# Altium project Self-Oscillating Converter.PrjPCB
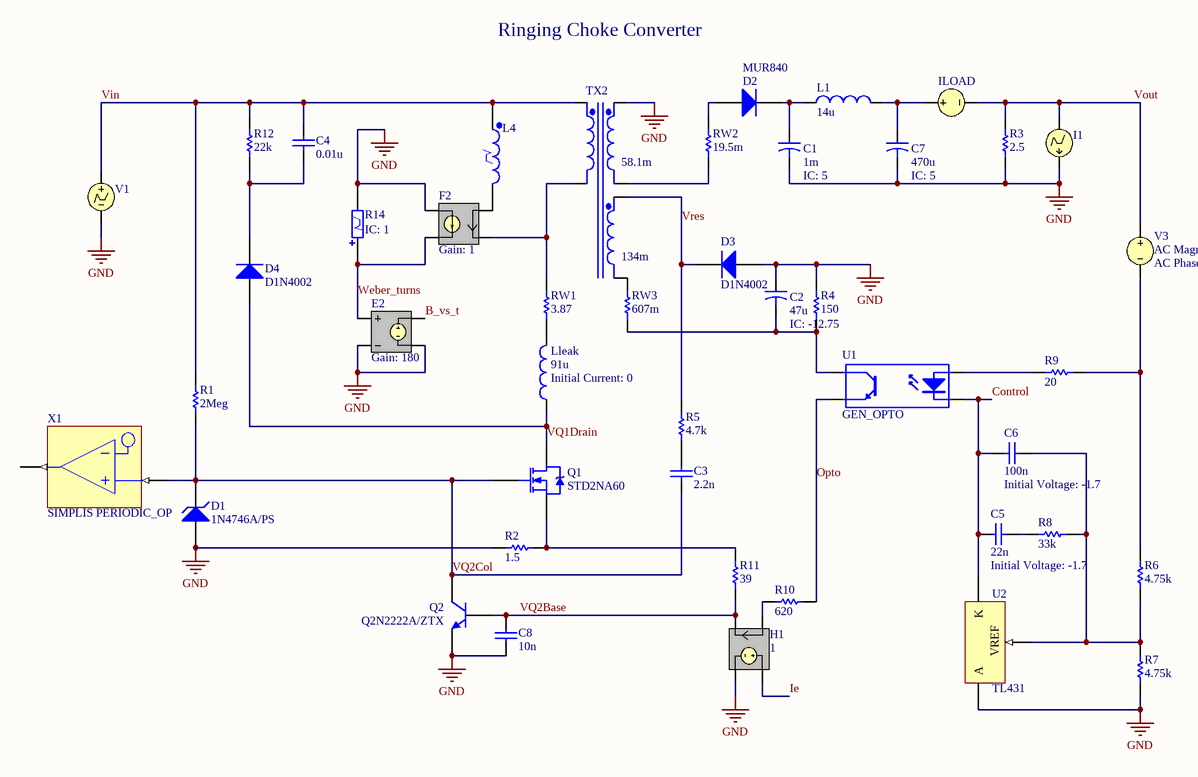
[diagram p0: Self-Oscillating Converter.SchDoc]
1 sheet, 44 parts. Net scope: global (net labels, ports and power ports of the same name join across sheets).

## Sheet Self-Oscillating Converter.SchDoc
size A4

### Parts
C1  IC: 5  CC: 1m  [CAPR5-4X5]  (hidden comment: Cap Elec (L1-3))
C2  IC: -12.75  CC: 47u  [CAPR5-4X5]  (hidden comment: Cap Elec (L1-3))
C3  value 2.2n  [RAD-0.3]  (hidden comment: Cap)
C4  value 0.01u  [RAD-0.3]  (hidden comment: Cap)
C5  value 22n  Initial Voltage: -1.7  [RAD-0.3]  (hidden comment: Cap)
C6  value 100n  Initial Voltage: -1.7  [RAD-0.3]  (hidden comment: Cap)
C7  IC: 5  CC: 470u  [CAPR5-4X5]  (hidden comment: Cap Elec (L1-3))
C8  value 10n  [RAD-0.3]  (hidden comment: Cap)
D1  1N4746A/PS  [59-03]
D2  MUR840  [SMC]
D3  D1N4002  [DO-41]
D4  D1N4002  [DO-41]
E2  Gain: 180  (hidden comment: ESRC)
F2  Gain: 1  (hidden comment: FSRC)
H1  Gain: 1  (hidden comment: HSRC)
I1  IPWL  (value not drawn)
ILOAD  VSRC  (value not drawn)
L1  value 14u  [0402-A]  (hidden comment: Lossy Inductor)
L4  SIMPLIS PWLL5  (value not drawn)
Lleak  value 91u  Initial Current: 0  [0402-A]  (hidden comment: Inductor)
Q1  STD2NA60  [TO-220AB]
Q2  Q2N2222A/ZTX  [TO-18]
R1  value 2Meg  [AXIAL-0.3]  (hidden comment: Res1)
R2  value 1.5  [AXIAL-0.3]  (hidden comment: Res1)
R3  value 2.5  [AXIAL-0.3]  (hidden comment: Res1)
R4  value 150  [AXIAL-0.3]  (hidden comment: Res1)
R5  value 4.7k  [AXIAL-0.3]  (hidden comment: Res1)
R6  value 4.75k  [AXIAL-0.3]  (hidden comment: Res1)
R7  value 4.75k  [AXIAL-0.3]  (hidden comment: Res1)
R8  value 33k  [AXIAL-0.3]  (hidden comment: Res1)
R9  value 20  [AXIAL-0.3]  (hidden comment: Res1)
R10  value 620  [AXIAL-0.3]  (hidden comment: Res1)
R11  value 39  [AXIAL-0.3]  (hidden comment: Res1)
R12  value 22k  [AXIAL-0.3]  (hidden comment: Res1)
R14  IC: 1  (hidden comment: SIMPLIS VPWLR5)
RW1  value 3.87  [AXIAL-0.3]  (hidden comment: Res1)
RW2  value 19.5m  [AXIAL-0.3]  (hidden comment: Res1)
RW3  value 607m  [AXIAL-0.3]  (hidden comment: Res1)
TX2  Ratio1: 58.1m  Ratio2: 134m  [TRF_6]  (hidden comment: Trans3 Ideal)
U1  GEN_OPTO  [DIP-4]
U2  TL431  [LP03]
V1  VPWL  (value not drawn)
V3  AC Magnitude: 1  AC Phase: 0  (hidden comment: VSRC)
X1  SIMPLIS PERIODIC_OP

### Nets
GND: C1.2 C2.1 C7.2 C8.2 D1.1(A) D3.1(A) E2.2(NC-) E2.4(N-) F2.3(N+) H1.4(N-) I1.2 Q2.1(E) R2.1 R3.2 R4.1 R7.1 R14.2 TX2.3(Sec1+) U2.2(A) V1.2
B_vs_t: E2.3(N+)
Control: C5.2 C6.2 U1.2(K) U2.3(K)
Ie: H1.3(N+)
Opto: R10.1 U1.3(E)
Vin: C4.1 L4.1 R1.1 R12.1 TX2.1(Pri+) V1.1
Vout: I1.1 ILOAD.2 R3.1 V3.1
VQ1Drain: D4.1(A) Lleak.1 Q1.2(D)
VQ2Base: C8.1 H1.2(NC-) Q2.2(B) R11.1
VQ2Col: C3.1 D1.2(K) Q1.1(G) Q2.3(C) R1.2 X1.1(IN)
Vres: D3.2(K) R5.1 TX2.5(Sec2+)
Weber_turns: E2.1(NC+) F2.4(N-) R14.1
NetC1_1: C1.1 D2.2(K) L1.1
NetC2_2: C2.2 R4.2 RW3.2 U1.4(C)
NetC3_2: C3.2 R5.2
NetC4_2: C4.2 D4.2(K) R12.2
NetC5_1: C5.1 R8.1
NetC6_1: C6.1 R6.1 R7.2 R8.2 U2.1(VREF)
NetC7_1: C7.1 ILOAD.1 L1.2
NetD2_1: D2.1(A) RW2.1
NetF2_1: F2.1(NC+) L4.2
NetF2_2: F2.2(NC-) RW1.1 TX2.2(Pri-)
NetH1_1: H1.1(NC+) R10.2
NetLleak_2: Lleak.2 RW1.2
NetQ1_3: Q1.3(S) R2.2 R11.2
NetR6_2: R6.2 R9.2 V3.2
NetR9_1: R9.1 U1.1(A)
NetRW2_2: RW2.2 TX2.4(Sec1-)
NetRW3_1: RW3.1 TX2.6(Sec2-)

Not connected (* = marked no-connect by the designer): X1 3(OUT)

### Notes on the sheet
- Ringing Choke Converter

### Library data of the parts
C1 = Cap Elec (L1-3): Electrolytic Capacitor (Levels 1-3); LEVEL: 2; RSH_CC: 1Meg; RESR: 40m; USEIC: 1; Published: 23-Sep-2002; PackageReference: CAPR5-4X5; Publisher: Altium Limited
C2 = Cap Elec (L1-3): Electrolytic Capacitor (Levels 1-3); LEVEL: 2; RSH_CC: 1Meg; RESR: 950m; USEIC: 1; Published: 23-Sep-2002; PackageReference: CAPR5-4X5; Publisher: Altium Limited
C3-C6 C8 = Cap: Capacitor; Published: 8-Jun-2000; LatestRevisionDate: 17-Jul-2002; LatestRevisionNote: Re-released for DXP Platform.; PackageReference: RAD-0.3; Publisher: Altium Limited
C7 = Cap Elec (L1-3): Electrolytic Capacitor (Levels 1-3); LEVEL: 2; RSH_CC: 1Meg; RESR: 290m; USEIC: 1; Published: 23-Sep-2002; PackageReference: CAPR5-4X5; Publisher: Altium Limited
D1 = 1N4746A/PS: One Watt Hermetically Sealed Glass Silicon Zener Diode; Published: 29-Sep-2000; LatestRevisionDate: 17-Jul-2002; LatestRevisionNote: Re-released for DXP Platform.; PackageReference: 59-03; Publisher: Altium Limited; PackageDescription: Diode, Axial; Body 5.2 x 2.7 mm (LxDia. max), Lead Dia. 0.86 mm (max); Code_JEDEC: DO-204-AL; ComponentLink1Description: Manufacturer Link; ComponentLink1URL: http://www.onsemi.com/site/products/landing?taxonomyID=194
D2 = MUR840: Ultrafast Recovery Rectifier; Published: 8-Jun-2000; LatestRevisionDate: 17-Jul-2002; LatestRevisionNote: Re-released for DXP Platform.; PackageDocument: Sep-1996; PackageReference: SMC; Publisher: Altium Limited; Code_JEDEC: DO-214-AB
D3 D4 = D1N4002: 1 Amp General Purpose Rectifier; Published: 8-Jun-2000; LatestRevisionDate: 17-Jul-2002; LatestRevisionNote: Re-released for DXP Platform.; DatasheetDocument: 1998; PackageDocument: Aug-1999; PackageReference: DO-41; Publisher: Altium Limited; Code_JEDEC: DO-204-AL; ComponentLink1Description: Manufacturer Link; ComponentLink1URL: http://www.fairchildsemi.com/; ComponentLink2Description: Datasheet; ComponentLink2URL: http://www.fairchildsemi.com/ds/1N%2F1N4001.pdf
E2 = ESRC: Voltage Controlled Voltage Source; Note: PCB Footprint - Not required; Sim Note: Enter gain into gain field; Published: 8-Jun-2000; LatestRevisionDate: 17-Jul-2002; LatestRevisionNote: Re-released for DXP Platform.; PackageReference: Not Applicable; Publisher: Altium Limited
F2 = FSRC: Current Controlled Current Source; Note: PCB Footprint - Not required; Sim Note: Enter gain into GAIN field; Published: 8-Jun-2000; LatestRevisionDate: 17-Jul-2002; LatestRevisionNote: Re-released for DXP Platform.; PackageReference: Not Applicable; Publisher: Altium Limited
H1 = HSRC: Current Controlled Voltage Source; Note: PCB Footprint - Not required; Sim Note: Enter gain into gain field; Published: 8-Jun-2000; LatestRevisionDate: 17-Jul-2002; LatestRevisionNote: Re-released for DXP Platform.; PackageReference: Not Applicable; Publisher: Altium Limited
I1 = IPWL: Piecewise Linear Current Source; Sim Note: To add model file containing time-current pairs of values, enter model location under "General Tab" in "Full Path" box.; Time-Value Pairs: 0 0 99.99999u 0 100u 1; Published: 8-Jun-2000; LatestRevisionDate: 17-Jul-2002; LatestRevisionNote: Re-released for DXP Platform.; PackageReference: Not Applicable; Publisher: Altium Limited
ILOAD V3 = VSRC: Voltage Source; Note: PCB Footprint - Not required; Value: 0; Published: 8-Jun-2000; LatestRevisionDate: 17-Jul-2002; LatestRevisionNote: Re-released for DXP Platform.; PackageReference: Not Applicable; Publisher: Altium Limited
L1 = Inductor (Lossy): Code_IEC: 1005; RSERIES: 10m; RSHUNT: 1Meg; Published: 8-Jun-2000; LatestRevisionDate: 17-Jul-2002; LatestRevisionNote: Re-released for DXP Platform.; PackageReference: 0402-A; Publisher: Altium Limited; Code_JEITA: 0402
L4 = SIMPLIS PWLL5: Piecewise Linear Inductor (5-segment); X0: -0.50; Y0: -1.655m; X1: -0.45; Y1: -1.65m; X2: -0.40; Y2: -1.6m; X3: 0.40; Y3: 1.6m; X4: 0.45; Y4: 1.65m; X5: 0.50; Y5: 1.655m; Published: 24-Mar-1999; LatestRevisionDate: 17-Jul-2002; LatestRevisionNote: Re-released for DXP Platform.; PackageReference: DIODE_SMC; Publisher: Altium Limited
Lleak = Inductor: Code_IEC: 1005; Published: 8-Jun-2000; LatestRevisionDate: 17-Jul-2002; LatestRevisionNote: Re-released for DXP Platform.; PackageReference: 0402-A; Publisher: Altium Limited; Code_JEITA: 0402
Q1 = STD2NA60: N-Channel Enhancement Mode Power MOS Transistor; Note: Pin 2 is electrically connected to pin 4.; Published: 8-Jun-2000; LatestRevisionDate: 17-Jul-2002; LatestRevisionNote: Re-released for DXP Platform.; DatasheetVersion: PD-9.307O; PackageVersion: Feb-1997; PackageReference: TO-220AB; Publisher: Altium Limited; PackageDescription: TO, Thru-Hole, Vertical, Heatsink Mounted; 3 In-Line Leads; Pitch 2.54 mm; ComponentLink1Description: Manufacturer Link; ComponentLink1URL: http://www.irf.com/; ComponentLink2Description: Datasheet; ComponentLink2URL: http://www.irf.com/product-info/datasheets/data/irf530.pdf
Q2 = Q2N2222A/ZTX: Zetex General Purpose Transistor NPN Silicon; Published: 29-Sep-2000; LatestRevisionDate: 17-Jul-2002; LatestRevisionNote: Re-released for DXP Platform.; DatasheetVersion: 1991; PackageVersion: 1997; PackageReference: 22-03; Publisher: Altium Limited; PackageDescription: Can; 3 Leads; Pin Circle Dia. 2.54 mm; Lead Dia. 0.48 mm (max); ComponentLink1Description: Manufacturer Link; ComponentLink1URL: http://www.onsemi.com/site/products/landing?taxonomyID=194
R1-R12 RW1-RW3 = Res1: Resistor; Published: 8-Jun-2000; LatestRevisionDate: 17-Jul-2002; LatestRevisionNote: Re-released for DXP Platform.; PackageReference: AXIAL-0.3; Publisher: Altium Limited
R14 = SIMPLIS VPWLR5: Voltage-Controlled Piecewise Linear Resistor (5-segment); X0: -1.655m; Y0: -0.5; X1: -1.65m; Y1: -0.45; X2: -1.6m; Y2: -0.4; X3: 1.6m; Y3: 0.4; X4: 1.65m; Y4: 0.45; X5: 1.655m; Y5: 0.5; Published: 24-Mar-1999; LatestRevisionDate: 04-Mar-2005; LatestRevisionNote: PCB Footprint replaced.; PackageReference: 6-0805; Publisher: Altium Limited
TX2 = Trans3 Ideal: Three-winding Transformer (Ideal); Published: 25-Jan-2001; LatestRevisionDate: 17-Jul-2002; LatestRevisionNote: Re-released for DXP Platform.; PackageReference: TRF_6; Publisher: Altium Limited
U1 = GEN_OPTO: General-Purpose Optocoupler; Published: 24-Mar-1999; LatestRevisionDate: 04-Mar-2005; LatestRevisionNote: Sch pins 3 & 4 Swapped.; DatasheetDocument: Nov-2003; PackageReference: DIP-4; Publisher: Altium Limited
U2 = TL431: Adjustable Precision Shunt Regulator; Published: 15-Apr-2002; LatestRevisionDate: 06-Jun-2005; LatestRevisionNote: Sch pins 1 & 3 swapped; DatasheetVersion: Oct-2000; PackageReference: LP03; Publisher: Altium Limited; PackageDescription: TO, Flat Index; 3 In-Line, Axial Leads; Body Dia. 4.8mm; Leads 0.56 x 0.41 mm (max); ComponentLink1Description: Manufacturer Link; ComponentLink1URL: http://www.ti.com/; ComponentLink2Description: Datasheet; ComponentLink2URL: http://www-s.ti.com/sc/ds/tl431a.pdf; PackageVersion: Nov-2001; Code_JEDEC: TO-226-AA
V1 = VPWL: Piecewise Linear Voltage Source; Note: PCB Footprint - Not required; Sim Note: To add model file containing time-current pairs of values, enter model location under "General Tab" in "Full Path" box.; Time-Value Pairs: 0 310 0 310 10u 310; Published: 8-Jun-2000; LatestRevisionDate: 17-Jul-2002; LatestRevisionNote: Re-released for DXP Platform.; PackageReference: Not Applicable; Publisher: Altium Limited
X1 = SIMPLIS PERIODIC_OP: Periodic Operating Point Analysis Trigger; XilinxEquivalent: XNOR2; FunctionalClass: Logic Primitive; SubClass: XNOR; PortSize: 2; PortStyle: Single Pin Version; ArchiveName: GENERIC; VHDLIB_SIM: GENERIC_LIB; Published: 29-Jan-2004; Publisher: Altium Limited; LastRevisionNo: 1.00.00; HelpURL: CR0118 FPGA Generic Library Guide.pdf#page=445; ComponentLink1URL: CR0136 FPGA Logic Primitive Resource Usage.pdf#page=252; ComponentLink1Description: Core &Resource Usage